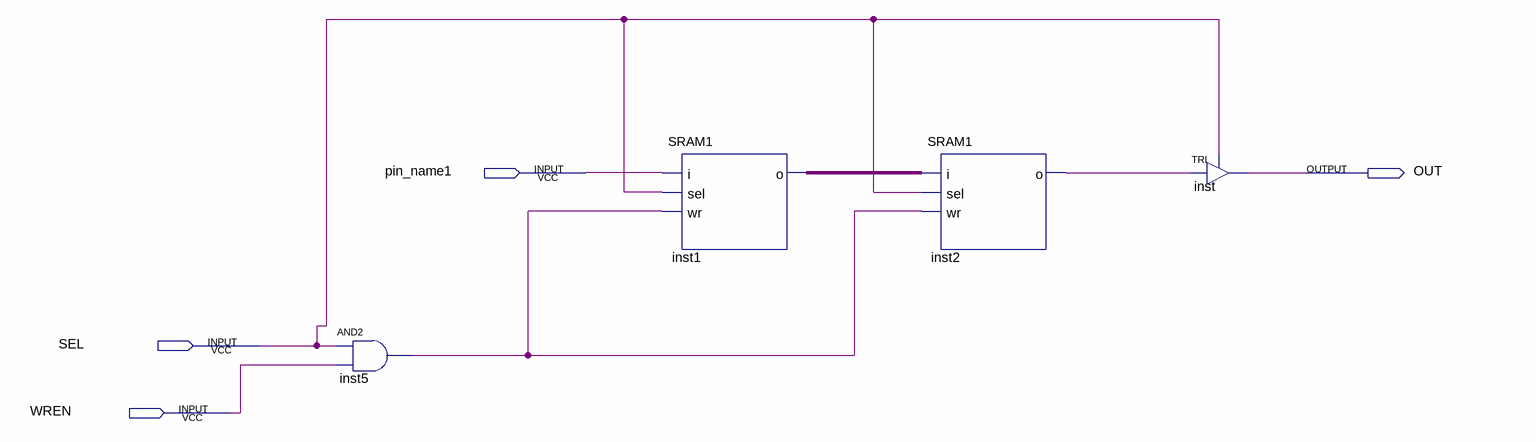
[diagram p0: schematic sheet]
// Quartus schematic SINGLESRAM.bdf as structural Verilog: 4 symbols, 4 pins
module SINGLESRAM (
  input  pin_name1,
  input  SEL,
  input  WREN,
  output OUT
);

  wire inst1_o, inst2_o, inst5_out;

  and inst5 (inst5_out, SEL, WREN);
  SRAM1 inst1 (.i(pin_name1), .sel(SEL), .wr(inst5_out), .o(inst1_o));
  SRAM1 inst2 (.i(inst1_o), .sel(SEL), .wr(inst5_out), .o(inst2_o));
  TRI inst (.IN(inst2_o), .OE(SEL), .OUT(OUT));
endmodule
